# EAGLE design 2017-09-15_drum_circuits (EAGLE 9.0.1)
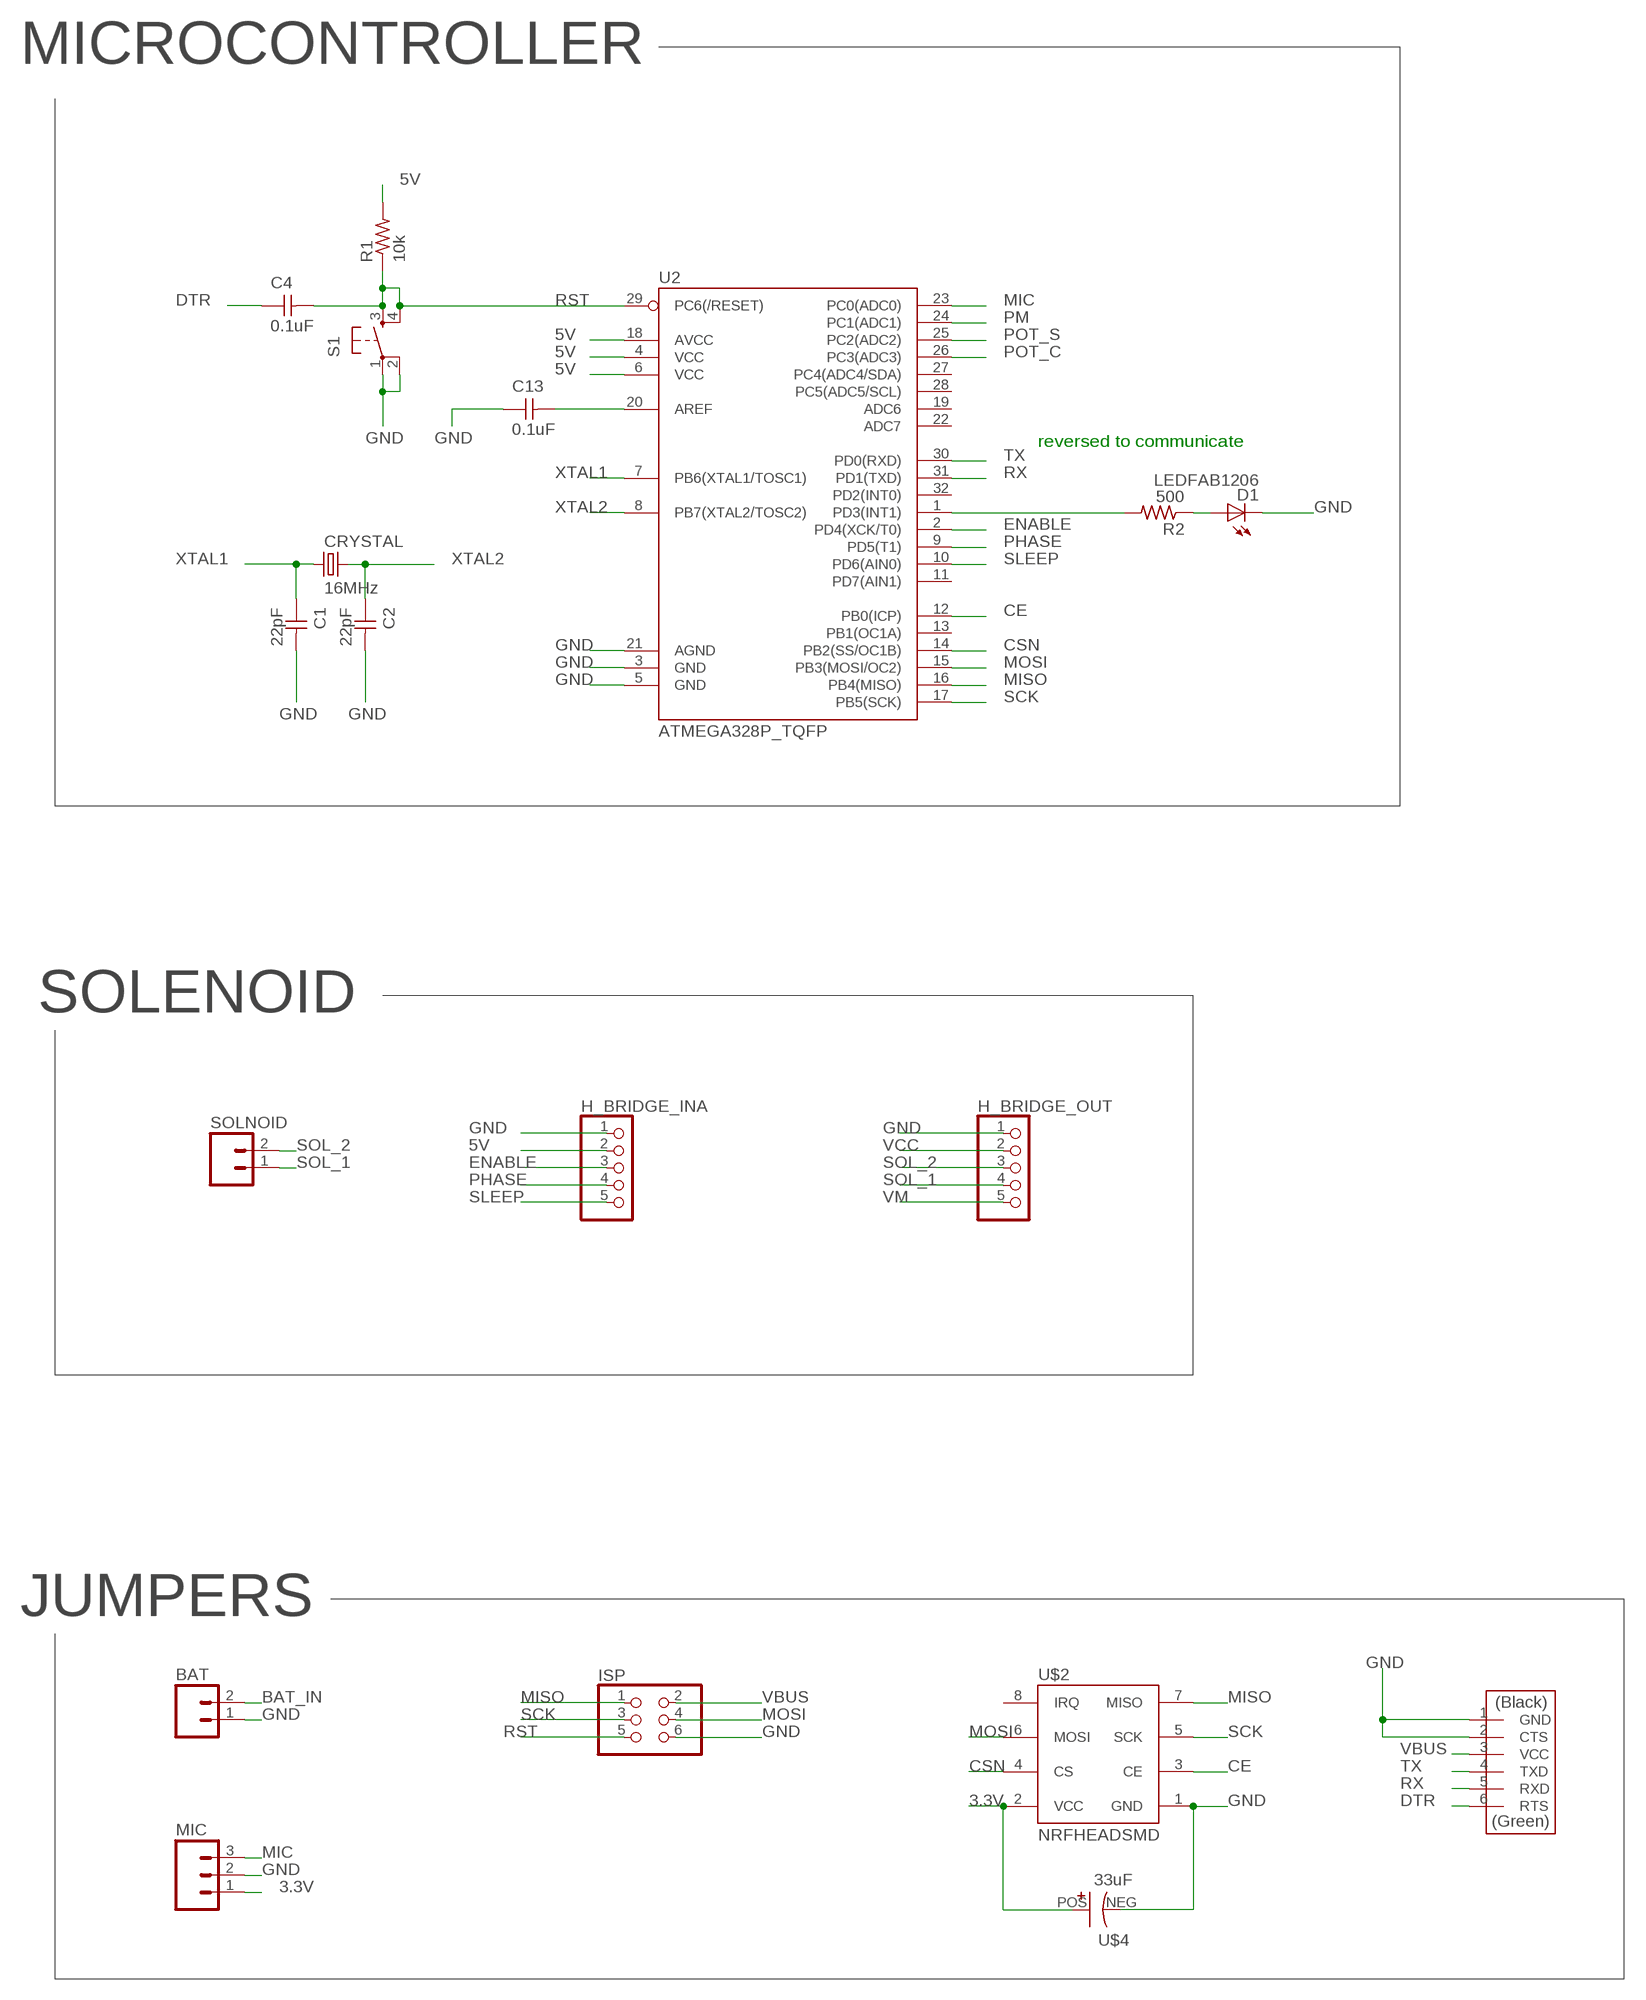
[diagram p0: schematic, sheet 1, part 1 of 2]
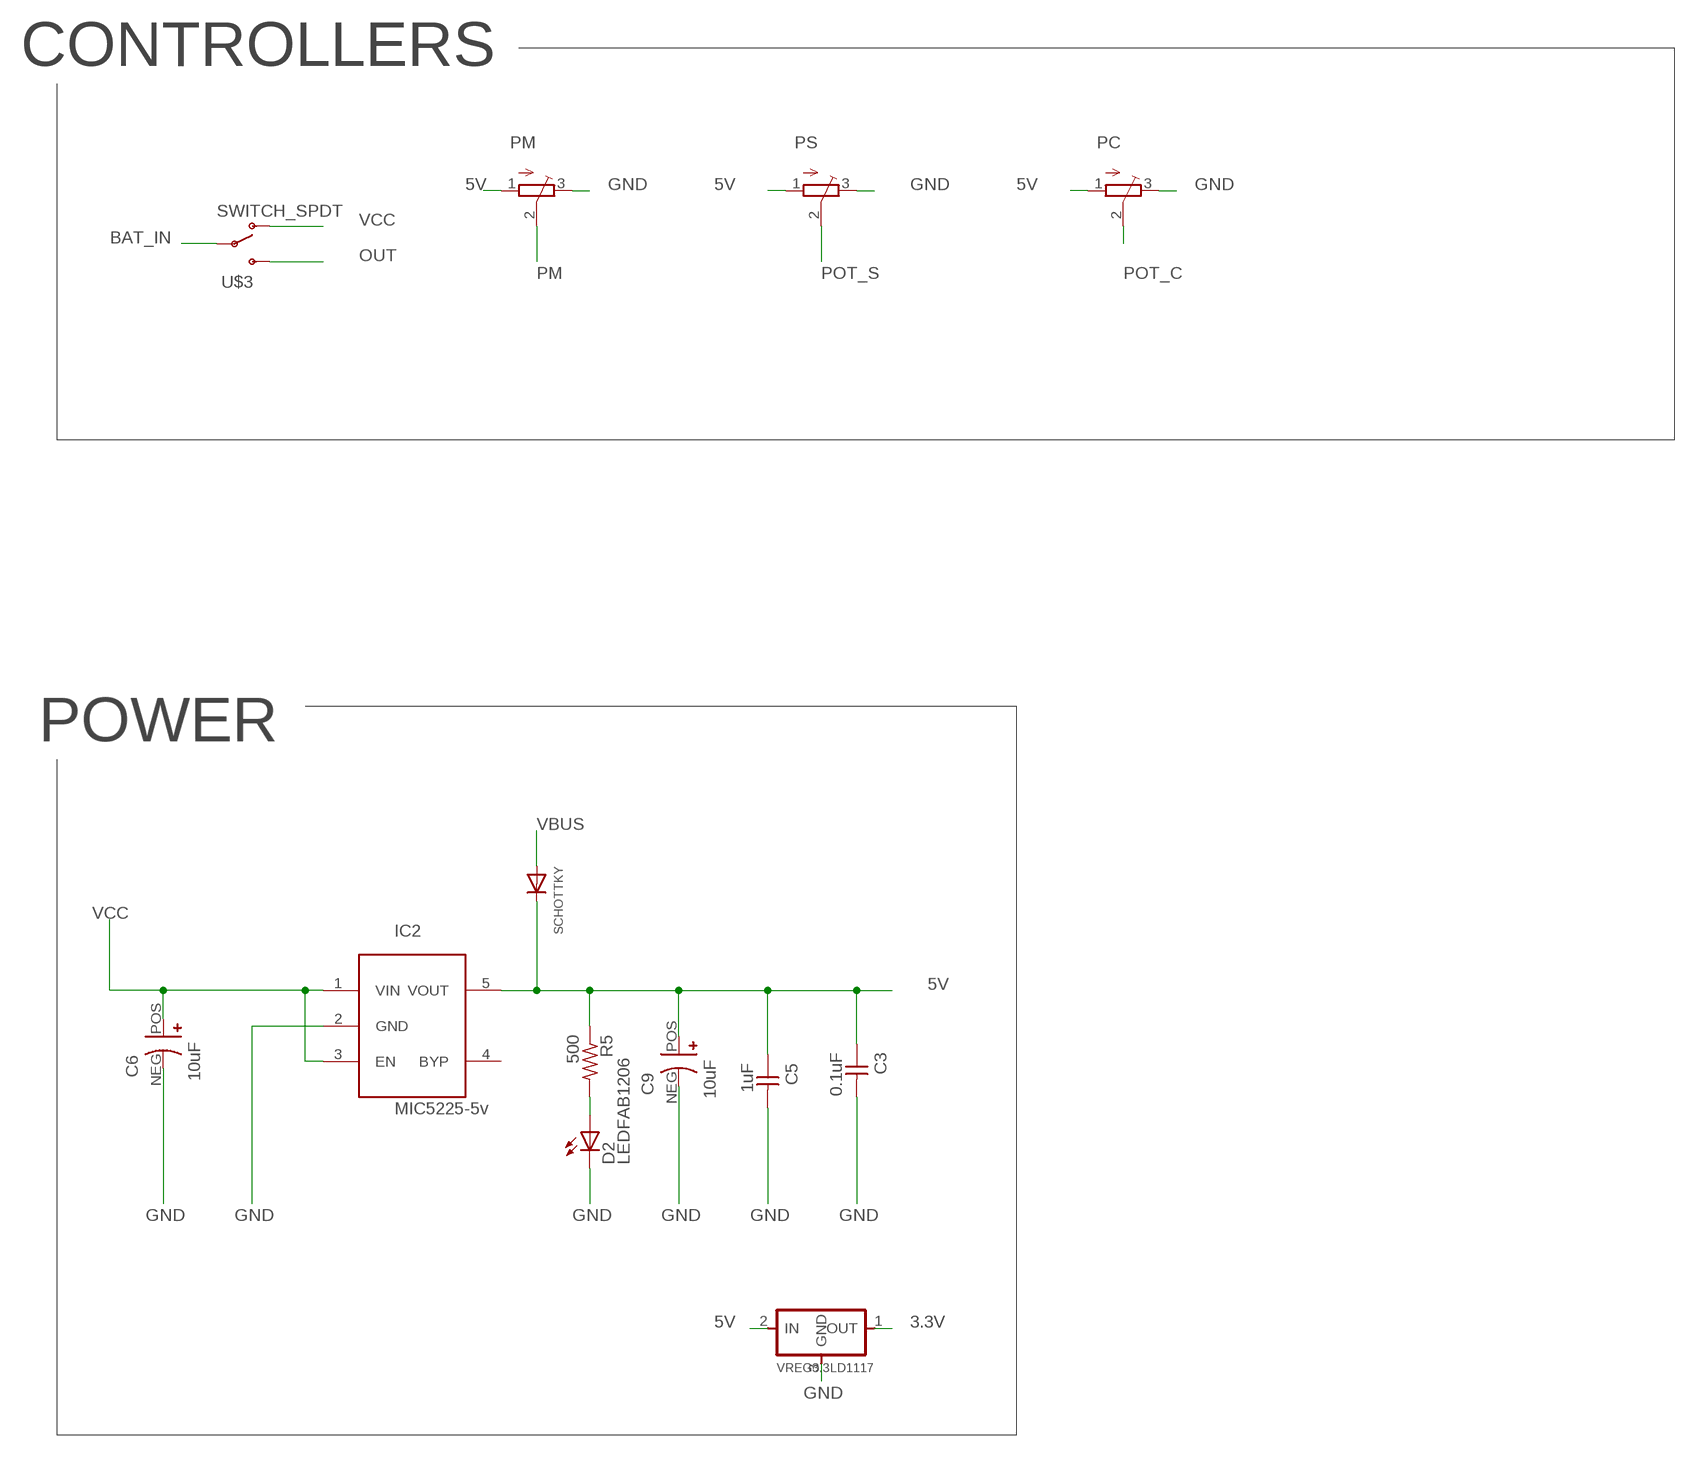
[diagram p1: schematic, sheet 1, part 2 of 2]

## Parts
BAT  M02PTH  [1X02]
C1  22pF  CAP-UNPOLARIZEDFAB  [C1206FAB]
C2  22pF  CAP-UNPOLARIZEDFAB  [C1206FAB]
C3  0.1uF  CAP-UNPOLARIZEDFAB  [C1206FAB]
C4  0.1uF  CAP-UNPOLARIZEDFAB  [C1206FAB]
C5  1uF  CAP-UNPOLARIZEDFAB  [C1206FAB]
C6  10uF  POLCAP-PANASONIC-SMD-B01  [PANASONIC-CAP-SMD-B]
C9  10uF  POLCAP-PANASONIC-SMD-B01  [PANASONIC-CAP-SMD-B]
C13  0.1uF  CAP-UNPOLARIZEDFAB  [C1206FAB]
CRYSTAL  16MHz  CRYSTAL  [2-SMD-5X3MM]
D1  LEDFAB1206  [LED1206FAB]
D2  LEDFAB1206  [LED1206FAB]
H_BRIDGE_INA  PINHD-1X05_2.54-SMD  [1X05SMD]
H_BRIDGE_OUT  PINHD-1X05_2.54-SMD  [1X05SMD]
IC2  MIC5225-5v  LP298XS  [SOT23-5L]
ISP  PINHD-2X3-SMD  [2X03SMD]
MIC  M03PTH  [1X03]
PC  TRIMPOTTC33X  [TC33X]
PM  TRIMPOTTC33X  [TC33X]
PS  TRIMPOTTC33X  [TC33X]
R1  10k  RES-US1206FAB  [R1206FAB]
R2  500  RES-US1206FAB  [R1206FAB]
R5  500  RES-US1206FAB  [R1206FAB]
S1  6MM_SWITCH6MM_SWITCH  [6MM_SWITCH]
SCHOTTKY  DIODE_SOD-123FL  [SOD-123FL]
SOLNOID  M02PTH  [1X02]
U2  ATMEGA328P_TQFP  [TQFP32-08]
U$1  FTDI-SMD-HEADER  [1X06SMD]
U$2  NRFHEADSMD  [2.54MM]
U$3  SWITCH_SPDT  [KPS-1290]
U$4  33uF  POLCAP-PANASONIC-SMD-C  [PANASONIC-CAP-SMD-C]
VREG3.3  LD1117  REGULATORSOT23  [SOT23]

## Nets
3.3V: MIC.1 U$2.2(VCC) U$4.POS(+) VREG3.3.1(OUT)
5V: C3.1 C5.1 C9.POS(+) H_BRIDGE_INA.2 IC2.5(VOUT) PC.1(A) PM.1(A) PS.1(A) R1.2 R5.1 SCHOTTKY.C U2.4(VCC) U2.6(VCC) U2.18(AVCC) VREG3.3.2(IN)
BAT_IN: BAT.2 U$3.P
CE: U2.12(PB0(ICP)) U$2.3(CE)
CSN: U2.14(PB2(SS/OC1B)) U$2.4(CS)
DTR: C4.1 U$1.6(RTS)
ENABLE: H_BRIDGE_INA.3 U2.2(PD4(XCK/T0))
GND: BAT.1 C1.2 C2.2 C3.2 C5.2 C6.NEG(-) C9.NEG(-) C13.1 D1.2(C) D2.2(C) H_BRIDGE_INA.1 H_BRIDGE_OUT.1 IC2.2(GND) ISP.6 MIC.2 PC.3(E) PM.3(E) PS.3(E) S1.1(P) S1.2(P1) U2.3(GND) U2.5(GND) U2.21(AGND) U$1.1(GND) U$1.2(CTS) U$2.1(GND) U$4.NEG(-) VREG3.3.3(GND)
MIC: MIC.3 U2.23(PC0(ADC0))
MISO: ISP.1 U2.16(PB4(MISO)) U$2.7(MISO)
MOSI: ISP.4 U2.15(PB3(MOSI/OC2)) U$2.6(MOSI)
N$1: D1.1(A) R2.1
N$6: D2.1(A) R5.2
N$9: C13.2 U2.20(AREF)
N$10: R2.2 U2.1(PD3(INT1))
OUT: U$3.S
PHASE: H_BRIDGE_INA.4 U2.9(PD5(T1))
PM: PM.2(S) U2.24(PC1(ADC1))
POT_C: PC.2(S) U2.26(PC3(ADC3))
POT_S: PS.2(S) U2.25(PC2(ADC2))
RST: C4.2 ISP.5 R1.1 S1.3(S) S1.4(S1) U2.29(PC6(/RESET))
RX: U2.31(PD1(TXD)) U$1.5(RXD)
SCK: ISP.3 U2.17(PB5(SCK)) U$2.5(SCK)
SLEEP: H_BRIDGE_INA.5 U2.10(PD6(AIN0))
SOL_1: H_BRIDGE_OUT.4 SOLNOID.1
SOL_2: H_BRIDGE_OUT.3 SOLNOID.2
TX: U2.30(PD0(RXD)) U$1.4(TXD)
VBUS: ISP.2 SCHOTTKY.A U$1.3(VCC)
VCC: C6.POS(+) H_BRIDGE_OUT.2 IC2.1(VIN) IC2.3(EN) U$3.O
VM: H_BRIDGE_OUT.5
XTAL1: C1.1 CRYSTAL.P$1 U2.7(PB6(XTAL1/TOSC1))
XTAL2: C2.1 CRYSTAL.P$2 U2.8(PB7(XTAL2/TOSC2))
Unconnected: IC2.4(BYP) U2.11(PD7(AIN1)) U2.13(PB1(OC1A)) U2.19(ADC6) U2.22(ADC7) U2.27(PC4(ADC4/SDA)) U2.28(PC5(ADC5/SCL)) U2.32(PD2(INT0)) U$2.8(IRQ)

## Notes on the sheet
- MICROCONTROLLER
- reversed to communicate
- SOLENOID
- JUMPERS
- CONTROLLERS
- POWER

## Library data of the parts
BAT SOLNOID = SparkFun-Connectors:M02: Standard 2-pin 0.1" header. Use with - straight break away headers ( PRT-00116) - right angle break away headers (PRT-00553) - swiss pins (PRT-00743) - machine pins (PRT-00117) - female headers (PRT-00115) Molex polarized connector foot print use with: PRT-08233 with associated crimp pins and housings. 2.54_SCREWTERM for use with PRT-10571. 3.5mm Screw Terminal footprints for PRT-08084 5mm Screw Terminal footprints for use with PRT-08432
C1-C5 C13 = fab:CAP-UNPOLARIZED
C6 C9 = talkingdrums:POLCAP-PANASONIC-SMD-B
CRYSTAL = fab:CRYSTAL
D1 D2 = fab:LED: LED
H_BRIDGE_INA H_BRIDGE_OUT = pinhead-2:PINHD-1X05: PIN HEADER
IC2 = adafruit:LP298X
ISP = fab:PINHD-2X3-SMD: PIN HEADER
MIC = SparkFun-Connectors:M03: Header 3 Standard 3-pin 0.1" header. Use with straight break away headers (SKU : PRT-00116), right angle break away headers (PRT-00553), swiss pins (PRT-00743), machine pins (PRT-00117), and female headers (PRT-00115). Molex polarized connector foot print use with SKU : PRT-08232 with associated crimp pins and housings.
PC PM PS = adafruit:TRIMPOT: SMT trimmer potentiometer part number TC33X http://www.ladyada.net/library/eagle
R1 R2 R5 = fab:RES-US: Resistor (US Symbol) Variants with postfix FAB are widened to allow the routing of internal traces
S1 = fab:6MM_SWITCH: OMRON SWITCH
SCHOTTKY = adafruit:DIODE: Diode SMADIODE - SMA Surface Mount Package 20V 1A Schottky Diode Digikey: 641-1014-6-ND DO-1N4148 - Through Hole Small Current Diode SOD-123 20V 1 A (.5mV Vf) Schottky Diode - Digikey: MBRX120TPMSCT-ND SOD-323 10V 570mA (.38mV Vf, 3ns) Schottky Diode - Digikey: ZLLS410CT-ND SOD-523 30V 30mA Schottky Diode (RB751S-40TE61) - Digikey: RB751S-40TE61CT-ND SOT23-R/W - SOT23 Package (R = Solder Paste/Reflow Ovens, W = Hand-Soldering) BAT54Film 40V 300mA - Digikey: 497-7162-1-ND
U2 = SparkFun-DigitalIC:ATMEGA328P_TQFP; PROD_ID: IC-09069
U$1 = fab:FTDI-SMD-HEADER
U$2 = nrf:NRFHEAD
U$3 = SparkFun-Electromechanical:SWITCH_SPDT: SWCH-10651 Side-actuated SPDT slide switch, as used on the Arduino Pro; PROD_ID: SWCH-10651
U$4 = talkingdrums:POLCAP-PANASONIC-SMD-C
VREG3.3 = fab:REGULATOR

## Board
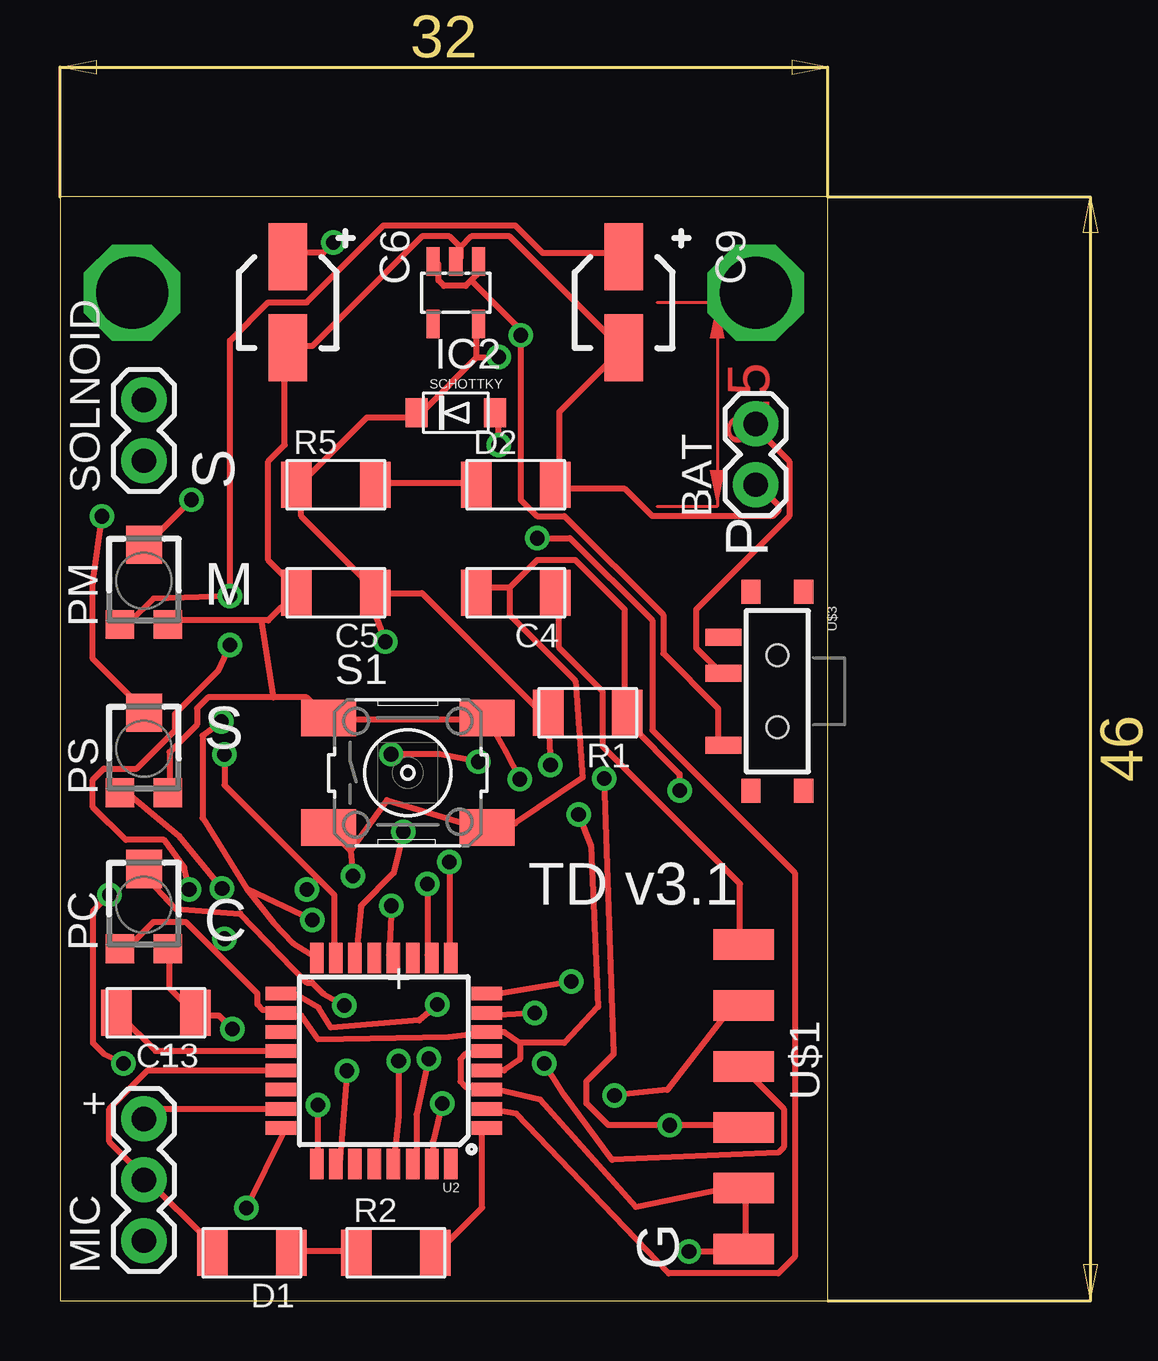
[diagram p2: board, top side]
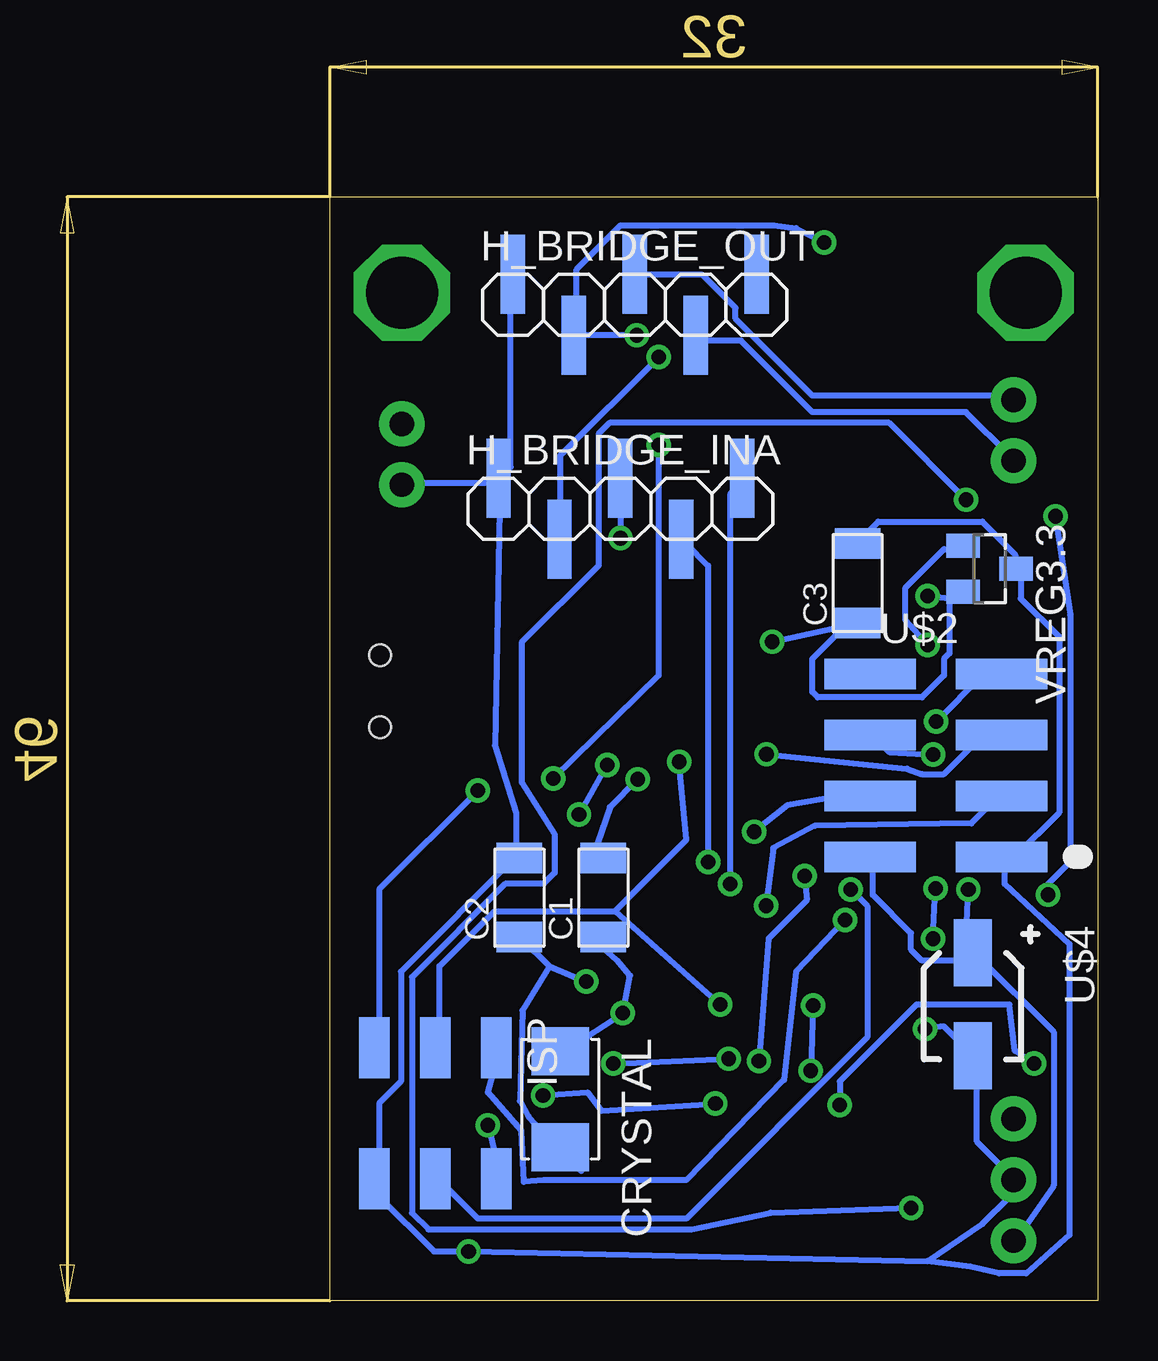
[diagram p3: board, bottom side, seen from below]

Size 32 x 46 mm. Coordinates in mm from the lower left corner, seen from the top.
Outline: 0,0 32,0 32,46 0,46 0,0
Copper layers (1*16): Top 0.035mm / dielectric 1.5mm / Bottom 0.035mm
Design rules "default": minimum track width 10mil, minimum drill 24mil, track to track 8mil, track to pad 8mil, pad to pad 8mil, via to via 8mil, smd to smd 8mil, copper to edge 40mil, drill to drill 8mil, minimum pad ring 10mil, minimum via ring 8mil, stop-mask expansion 4mil, vias tented up to drill 0mil, thermal gap 10mil

### Footprints (pad centres in the part's own frame; a part is rotated, then mirrored left to right if it is on the bottom)
1X02 = drill 1.016 pad 1.88: 1 0,0; 2 2.54,0
C1206FAB = smd 1.27 x 1.905: 1 -1.651,0; 2 1.651,0
PANASONIC-CAP-SMD-B = smd 1.6 x 2.794: NEG 0,3.794; POS 0,0
2-SMD-5X3MM = smd 2 x 2.4: P$1 -2,0; P$2 2,0
LED1206FAB = smd 1.27 x 1.905: 1 -1.651,0; 2 1.651,0
1X05SMD = smd 1.016 x 3.302: 1 -1.27,1.27; 2 1.27,-1.27; 3 3.81,1.27; 4 6.35,-1.27; 5 8.89,1.27
SOT23-5L = smd 0.55 x 1.2: 1 -0.95,-1.3; 2 0,-1.3; 3 0.95,-1.3; 4 0.95,1.3; 5 -0.95,1.3
2X03SMD = smd 2.54 x 1.27: 1 -2.54,2.54; 2 2.92,2.54; 3 -2.54,0; 4 2.92,0; 5 -2.54,-2.54; 6 2.92,-2.54
1X03 = drill 1.016 pad 1.88: 1 0,0; 2 2.54,0; 3 5.08,0
TC33X = smd 1.2 x 1.2: 1 -1,-1.825; 3 1,-1.825 | smd 1.5 x 1.6: 2 0,1.5
R1206FAB = smd 1.27 x 1.905: 1 -1.651,0; 2 1.651,0
6MM_SWITCH = smd 2.286 x 1.524: 1 -3.302,2.286; 2 3.302,2.286; 3 -3.302,-2.286; 4 3.302,-2.286
SOD-123FL = smd 0.91 x 1.22: A 1.637,0; C -1.637,0
TQFP32-08 = smd 1.27 x 0.559: 1 -4.293,2.8; 2 -4.293,2; 3 -4.293,1.2; 4 -4.293,0.4; 5 -4.293,-0.4; 6 -4.293,-1.2; 7 -4.293,-2; 8 -4.293,-2.8; 17 4.293,-2.8; 18 4.293,-2; 19 4.293,-1.2; 20 4.293,-0.4; 21 4.293,0.4; 22 4.293,1.2; 23 4.293,2; 24 4.293,2.8 | smd 0.559 x 1.27: 9 -2.8,-4.293; 10 -2,-4.293; 11 -1.2,-4.293; 12 -0.4,-4.293; 13 0.4,-4.293; 14 1.2,-4.293; 15 2,-4.293; 16 2.8,-4.293; 25 2.8,4.293; 26 2,4.293; 27 1.2,4.293; 28 0.4,4.293; 29 -0.4,4.293; 30 -1.2,4.293; 31 -2,4.293; 32 -2.8,4.293
1X06SMD = smd 2.54 x 1.27: 1 0,6.35; 2 0,3.81; 3 0,1.27; 4 0,-1.27; 5 0,-3.81; 6 0,-6.35
2.54MM = smd 3.81 x 1.27: 1 0,0; 2 -5.486,0; 3 0,2.54; 4 -5.486,2.54; 5 0,5.08; 6 -5.486,5.08; 7 0,7.62; 8 -5.486,7.62
KPS-1290 = smd 0.7 x 1.5: O -2.25,2.25; P 0.75,2.25; S 2.25,2.25 | smd 1 x 0.8: P$1 -4.15,1.1; P$2 -4.15,-1.1; P$3 4.15,-1.1; P$4 4.15,1.1 | hole 0.9: -1.5,0; 1.5,0
PANASONIC-CAP-SMD-C = smd 1.6 x 2.794: NEG 0,4.294; POS 0,0
SOT23 = smd 1 x 1.4: 1 -0.95,-1.1; 2 0.95,-1.1; 3 0,1.1

### Placement (x,y rotation side)
BAT  29,34 90 top
C1  20.6,16.8 90 bottom
C2  24.1,16.8 90 bottom
C3  10,29.9 90 bottom
C4  19,29.5 180 top
C5  11.5,29.5 180 top
C6  9.5,43.5 180 top
C9  23.5,43.5 180 top
C13  4,12 180 top
CRYSTAL  22.4,8.4 270 bottom
D1  8,2 180 top
D2  19,34 0 top
H_BRIDGE_INA  23.7,33 0 bottom
H_BRIDGE_OUT  23.1,41.5 0 bottom
IC2  16.5,42 180 top
ISP  27.6,8 270 bottom
MIC  3.5,2.5 90 top
PC  3.5,16.5 0 top
PM  3.5,30 0 top
PS  3.5,23 0 top
R1  22,24.5 180 top
R2  14,2 0 top
R5  11.5,34 0 top
S1  14.5,22 0 top
SCHOTTKY  16.5,37 0 top
SOLNOID  3.5,35 90 top
U2  13.5,10 180 top
U$1  28.5,8.5 180 top
U$2  4,18.5 0 bottom
U$3  29.9,25.4 90 top
U$4  5.2,14.5 180 bottom
VREG3.3  4.5,30.5 270 bottom

### Tracks (layer width: path | path; a pad name or v marks a point on that pad's centre or on a via)
3.3V  (via drill 0.61)
  Top 0.254: v7.09,27.33 6.59,26.25 4.8,24.46 4.8,23.77 3.2,22.17 1.83,22.17 1.37,21.72 1.37,20.57 2.74,19.2 4.34,19.2 5.19,18.06 v5.39,17.14
  Bottom 0.254: v7.09,27.33 8,28.35 8,29.72 6.4,31.32 5.71,31.32 VREG3.3.1 | v5.39,17.14 5.49,14.86 5.26,14.63 U$4.POS | MIC.1 3.43,2.52 2.93,3.2 1.83,4.8 1.83,11.2 5.03,14.4 U$4.POS | U$2.2 9.37,18.29 9.37,16.92 7.77,15.32 7.77,14.63 7.32,14.17 5.49,14.17 5.26,14.4 U$4.POS
5V  (via drill 0.61)
  Top 0.254: PM.1 2.52,28.35 2.97,28.35 3.89,29.26 v7.09,29.36 7.09,40.01 8.69,41.6 10.29,41.6 13.49,44.81 18.97,44.81 20.12,43.66 23.32,43.66 C9.POS | 19.17,10.74 19.17,10.06 18.52,9.6 17.83,9.6 U2.4 | 19.17,10.74 18.52,11.2 17.83,11.2 U2.6 16.2,11 10.74,10.9 10.06,11.89 9.37,11.89 U2.18 9.14,12.12 8.46,12.12 8.23,12.34 8.23,12.8 6.4,14.63 | 6.4,14.63 5.26,15.77 3.89,15.77 2.97,14.86 2.52,14.86 PC.1 | v6.76,17.17 4.97,19.36 4.24,19.96 2.97,21.03 2.52,21.03 PS.1 | 6.4,14.63 v6.86,15.09 | 17.37,39.32 17.37,40.69 IC2.5 | 17.37,39.32 15.09,37.03 SCHOTTKY.C 14.86,36.8 12.8,36.8 10.06,34.06 R5.1 10.06,33.83 10.06,32.69 12.57,30.18 | 17.37,39.32 v18.29,39.32 | C5.1 13.26,29.49 15.09,29.49 19.89,24.69 20.34,24.69 R1.2 20.34,24.46 v20.45,22.33 | 12.57,30.18 13.03,29.72 C5.1 | 19.17,10.74 21.03,10.74 22.43,12.24 22.13,18.95 v21.62,20.26 | 12.57,30.18 v13.56,27.46 | 12.57,30.18 C5.1
  Bottom 0.254: 6.17,29.26 5.94,29.26 5.71,29.49 VREG3.3.2 6.17,29.26 | 6.17,29.26 v7.09,29.36 | 10.52,28.12 10.06,28.12 C3.1 10.52,28.12 | 10.52,28.12 11.89,26.75 11.89,25.38 11.66,25.15 7.32,25.15 6.4,26.06 6.4,26.75 6.17,26.98 6.17,29.26 | v6.86,15.09 v6.76,17.17 | v18.29,39.32 22.4,35.2 22.4,31.77 H_BRIDGE_INA.2 | v20.45,22.33 v21.62,20.26 | v13.56,27.46 10.52,28.12
BAT_IN
  Top 0.254: U$3.P 27.43,26.29 26.52,27.2 26.52,28.8 30.4,32.69 30.4,34.98 29.03,36.35 BAT.2
CE  (via drill 0.61)
  Top 0.254: v13.82,16.46 13.72,14.4 U2.12
  Bottom 0.254: v13.82,16.46 13.52,18.87 11.8,19.79 5.26,19.89 4.12,21.03 U$2.3
CSN  (via drill 0.61)
  Top 0.254: v14.32,19.55 13.92,17.83 12.54,16.46 12.34,14.4 U2.14
  Bottom 0.254: v14.32,19.55 12.93,20.64 10.74,21.03 9.6,21.03 U$2.4
DTR
  Top 0.254: C4.1 20.8,29.49 20.8,27.2 22.63,25.38 22.63,23.09 28.35,17.37 28.35,14.86 U$1.6
ENABLE  (via drill 0.61)
  Top 0.254: v19.89,31.77 21.26,31.77 24.69,28.35 24.69,23.77 30.63,17.83 30.63,1.83 29.95,1.14 25.38,1.14 19.02,7.8 17.83,8 U2.2
  Bottom 0.254: v19.89,31.77 19.89,34.06 H_BRIDGE_INA.3
GND  (via drill 0.61)
  Top 0.254: 16.69,43.89 16.69,43.43 IC2.2 16.69,43.89 | 16.69,43.89 17.14,44.35 18.75,44.35 23.32,39.78 C9.NEG 23.32,39.55 20.8,37.03 20.8,34.06 D2.2 20.8,33.83 23.55,33.83 24.69,32.69 29.72,32.69 29.95,32.92 29.95,33.15 29.03,34.06 BAT.1 | 16.69,43.89 16.23,44.35 15.09,44.35 10.52,39.78 9.6,39.78 C6.NEG 9.37,39.55 9.37,35.66 8.69,34.98 8.69,30.86 9.83,29.72 C5.2 9.83,29.49 8.69,28.35 8.4,28.35 | v19.17,21.73 18.57,22.89 17.83,24.23 S1.2 17.6,24.23 11.2,24.23 S1.1 10.97,24.46 10.29,25.15 8.9,25.15 | 8.4,28.35 4.57,28.35 PM.3 | 8.9,25.15 6.17,25.15 5.71,24.69 5.71,24 4.57,22.86 4.57,21.26 PS.3 | 8.9,25.15 8.4,28.35 | PC.3 4.57,14.63 4.57,13.03 5.49,12.12 C13.1 5.71,11.89 6.63,11.89 v7.19,11.33 | U2.21 9.14,9.6 3.66,9.6 2.06,8 2.06,6.63 3.43,5.26 MIC.2 3.66,5.03 6.17,2.52 6.17,2.06 D1.2 | U2.5 17.6,10.29 16.92,10.29 16.69,10.06 16.69,9.14 16.92,8.91 17.6,8.91 U2.3 18.23,8.79 20.02,8.39 24,3.9 28.35,4.8 U$1.2 28.57,4.57 28.57,2.29 U$1.1 28.35,2.06 v26.22,2.06
  Bottom 0.254: v19.17,21.73 20.33,20.57 21.03,18.52 C1.2 | v7.19,11.33 6.4,11.43 5.26,10.29 U$4.NEG 5.03,10.06 5.03,6.63 3.66,5.26 MIC.2 3.66,5.03 3.66,4.34 4.8,3.2 7.1,1.66 | C3.2 9.83,31.77 9.14,32.46 4.8,32.46 3.43,31.09 3.43,30.63 VREG3.3.3 3.2,30.4 3.2,29.26 1.6,27.66 1.6,20.34 3.43,18.52 3.89,18.52 U$2.1 3.89,18.29 3.89,17.37 1.17,14.86 1.17,2.74 2.97,1.14 4.12,1.14 5.3,1.43 7.1,1.66 | 24.23,18.52 24.23,20.34 25.12,23.13 24.92,34.06 H_BRIDGE_INA.1 | 24.23,18.52 29.03,13.72 29.03,9.14 29.95,8.23 29.95,5.26 ISP.6 29.95,5.03 29.95,4.34 27.66,2.06 v26.22,2.06 7.1,1.66 | 24.23,18.52 C2.2 | H_BRIDGE_OUT.1 24.46,42.75 24.46,34.75 24.92,34.29 H_BRIDGE_INA.1 | BAT.1 28.8,34.06 25.15,34.06 H_BRIDGE_INA.1
MIC
  Top 0.254: U2.23 9.14,8 3.89,8 3.66,7.77 MIC.3
MISO  (via drill 0.61)
  Top 0.254: 7.79,17.17 5.94,20.12 5.94,23.55 v6.73,24.13 | 7.79,17.17 8.92,15.74 9.72,14.9 U2.16 | 7.79,17.17 v10.52,15.87
  Bottom 0.254: v6.73,24.13 4.8,26.06 4.12,26.06 U$2.7 | v10.52,15.87 12.57,13.72 13.07,9.2 17.14,5.03 23.09,5.03 23.92,4.96 24.02,7.09 25.42,8.69 24.92,10.52 ISP.1
MOSI  (via drill 0.61)
  Top 0.254: 10.74,17.6 6.86,21.49 v6.86,22.76 | 10.74,17.6 11.43,16.92 11.43,14.4 U2.15 | 10.74,17.6 v10.29,17.14
  Bottom 0.254: v6.86,22.76 8.69,22.86 9.37,23.55 U$2.6 | v10.29,17.14 9.6,16.46 9.6,10.97 17.14,3.43 25.83,3.43 27.43,5.03 ISP.4
N$1
  Top 0.254: D1.1 9.83,2.06 12.34,2.06 R2.1
N$3  (via drill 3 pad 1)
  other vias: 3,42
N$5  (via drill 3 pad 1)
  other vias: 29,42
N$6
  Top 0.254: R5.2 13.26,34.06 17.14,34.06 D2.1
N$9
  Top 0.254: U2.20 9.24,10.42 3.99,10.42 2.52,11.89 C13.2
N$10
  Top 0.254: U2.1 17.6,7.09 17.6,3.89 15.77,2.06 R2.2
PHASE  (via drill 0.61)
  Top 0.254: v16.23,18.29 16.23,14.4 U2.9
  Bottom 0.254: v16.23,18.29 16.23,30.63 17.14,31.55 H_BRIDGE_INA.4
PM  (via drill 0.61)
  Top 0.254: v7.77,3.87 9.37,7.09 U2.24 | v5.49,33.38 3.66,31.55 PM.2
  Bottom 0.254: v7.77,3.87 13.62,3.67 16.92,2.97 27.89,2.97 28.57,3.66 28.57,13.49 24.69,17.37 23.09,17.37 22.63,17.83 22.63,19.43 24,21.6 24,27.43 20.8,30.63 20.8,36.12 20.34,36.58 8.69,36.58 v5.49,33.38
POT_C  (via drill 0.61)
  Top 0.254: v11.96,9.59 11.66,5.71 U2.26 | v11.86,12.3 10.97,12.8 10.52,13.26 10.29,13.26 7.51,16.13 4.83,16.33 3.43,17.83 PC.2
  Bottom 0.254: v11.86,12.3 v11.96,9.59
POT_S  (via drill 0.61)
  Top 0.254: v10.74,8.16 10.74,5.71 U2.25 | v2.64,9.89 1.83,10.29 1.37,10.74 1.37,16.23 v2.06,16.92 | v1.76,32.69 1.37,29.9 1.37,26.75 3.43,24.69 PS.2
  Bottom 0.254: v10.74,8.16 10.74,9.14 7.54,12.34 3.67,12.34 3.44,10.42 v2.64,9.89 | v2.06,16.92 2.06,17.37 1.14,18.29 1.14,28.57 v1.76,32.69
RST  (via drill 0.61)
  Top 0.254: v14.12,9.99 14.12,7.71 U2.29 | 12.12,18.75 v12.22,17.7 | 12.12,18.75 11.2,19.66 S1.3 | 12.12,18.75 13.63,20.86 17.6,19.66 S1.4 17.83,19.89 18.97,19.89 21.79,21.8 21.49,25.83 18.75,28.57 18.75,29.72 | 18.75,29.72 17.37,29.72 C4.2 | 18.75,29.72 19.89,30.86 21.49,30.86 23.55,28.8 23.55,24.69 R1.1 23.77,24.46 23.77,24 25.83,21.95 v25.83,21.26
  Bottom 0.254: v14.12,9.99 13.72,15.09 12.12,16.69 v12.22,17.7 | v25.83,21.26 29.95,17.14 29.95,10.74 ISP.5
RX  (via drill 0.61)
  Top 0.254: v15.93,8.21 15.54,6.63 15.54,5.71 U2.31 | v23.11,8.56 25.32,8.79 28.05,12.32 U$1.5
  Bottom 0.254: v15.93,8.21 20.69,7.92 21.26,8.69 v23.11,8.56
SCK  (via drill 0.61)
  Top 0.254: v15.73,12.34 14.97,11.69 11.3,11.39 10.79,12.2 9.77,12.8 U2.17 | v13.8,22.77 15.83,22.77 v17.45,22.46
  Bottom 0.254: 20.12,16.23 v15.73,12.34 | 20.12,16.23 25.15,16.23 27.43,13.95 27.43,10.74 ISP.3 | v13.8,22.77 7.94,22.17 7.32,21.95 6.4,21.95 4.8,23.55 4.12,23.55 U$2.5 | v17.45,22.46 17.14,19.2 20.12,16.23
SLEEP  (via drill 0.61)
  Top 0.254: v15.32,17.37 15.32,14.4 U2.10
  Bottom 0.254: v15.32,17.37 15.32,33.6 14.86,34.06 H_BRIDGE_INA.5
SOL_1
  Bottom 0.254: H_BRIDGE_OUT.4 16.69,40.01 14.86,40.01 11.89,37.03 5.49,37.03 3.66,35.2 SOLNOID.1
SOL_2
  Bottom 0.254: H_BRIDGE_OUT.3 19.2,42.75 16.46,42.75 15.09,41.38 15.09,40.92 11.89,37.72 3.66,37.72 SOLNOID.2
TX  (via drill 0.61)
  Top 0.254: v15.37,10.09 14.86,7.77 14.86,5.71 U2.30 | v20.19,9.89 21,8.59 23.02,5.87 29.95,6.17 30.18,6.4 30.18,8 28.57,9.6 U$1.4
  Bottom 0.254: v20.19,9.89 v15.37,10.09
VBUS  (via drill 0.61)
  Top 0.254: v18.29,35.66 18.29,36.8 SCHOTTKY.A | v22.69,21.76 23.09,10.29 21.95,9.14 21.95,8.23 22.86,7.32 v25.42,7.32 28.35,7.32 U$1.3
  Bottom 0.254: v18.29,35.66 18.29,26.06 v22.69,21.76 | v25.42,7.32 24.92,5.26 ISP.2
VCC  (via drill 0.61)
  Top 0.254: v11.4,44.09 10.97,43.66 9.6,43.66 C6.POS | 17.14,42.52 17.37,42.75 17.37,43.2 IC2.1 | 17.14,42.52 16.92,42.29 16,42.29 15.77,42.52 15.77,43.2 IC2.3 | 17.14,42.52 19.2,40.46 v19.2,40.23 19.2,33.38 19.89,32.69 21.03,32.69 25.15,28.57 25.15,26.98 27.43,24.69 27.43,23.32 U$3.O
  Bottom 0.254: v11.4,44.09 12.57,44.69 13.49,44.81 19.89,44.81 21.72,42.98 21.72,40.23 | v19.2,40.23 21.72,40.23 | 21.72,40.23 H_BRIDGE_OUT.2
XTAL1  (via drill 0.61)
  Top 0.254: v19.79,11.99 17.83,11.89 U2.7
  Bottom 0.254: CRYSTAL.P$1 22.09,10.49 v19.79,11.99 19.49,13.54 20.03,14.19 21.03,15.09 C1.1
XTAL2  (via drill 0.61)
  Top 0.254: v21.32,13.3 17.83,12.7 U2.8
  Bottom 0.254: 22.85,13.93 24,15.09 C2.1 | 22.85,13.93 23.97,12.1 24.07,8.33 23.72,7.67 22.89,6.77 21.52,5.4 CRYSTAL.P$2 | 22.85,13.93 v21.32,13.3
(copper drawn outside any net)
  shapes: Top area x1

### Text on the board
tPlace: S | - | P | M | S | TD v3.1 | C | + | - | + | G